# EAGLE design skycontrol-2008 (EAGLE 4.16)

## Sheet 1 of 2
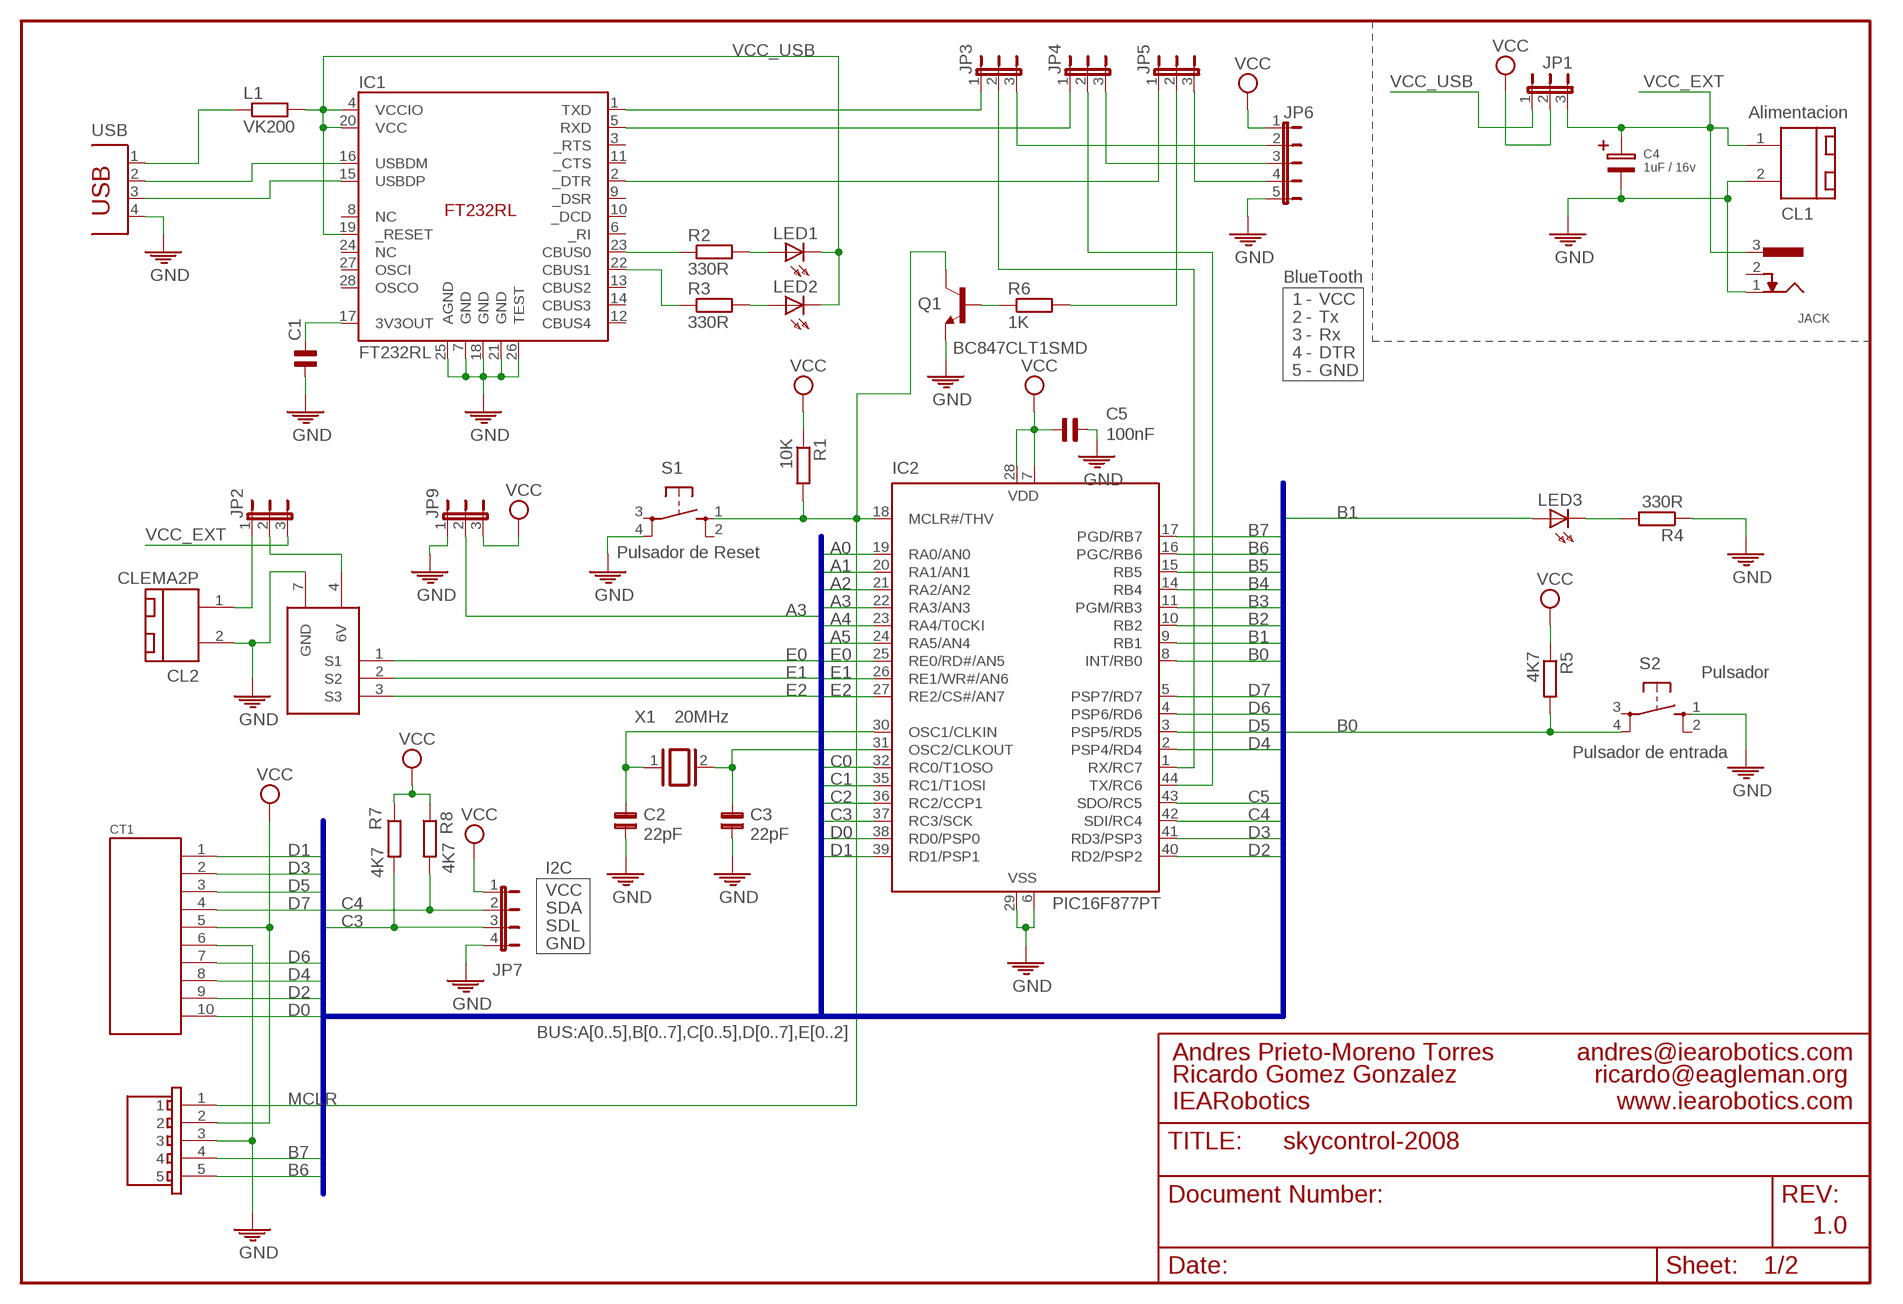
[diagram p0: schematic, sheet 1]

### Parts
C1  CON-MUL  [C0805K]
C2  22pF  CON-MUL  [C0805K]
C3  22pF  CON-MUL  [C0805K]
C4  1uF / 16v  CON-ELE-2.5  [C2]
C5  100nF  CON-MUL  [C0805K]
CL1  Alimentacion  CLEMA2P  [C2P]
CL2  CLEMA2P  [C2P]
CP1  CON-POWER-5RECTO  [CON-POWER-5]
CT1  CTCONA  [CTCON]
IC1  FT232RL  [SSOP-28]
IC2  PIC16F877PT  [TQFP44]
JACK  JACKP  [JACK]
JP1  JUMPER3R  [JP3R]
JP2  JUMPER3R  [JP3R]
JP3  JUMPER3R  [JP3R]
JP4  JUMPER3R  [JP3R]
JP5  JUMPER3R  [JP3R]
JP6  JUMPER5R  [1X05]
JP7  JUMPER4R  [1X04]
JP9  JUMPER3R  [JP3R]
L1  VK200  RESISTENCIA-10  [R207/10]
LED1  LED_SMD-SMT1206  [LED-1206]
LED2  LED_SMD-SMT1206  [LED-1206]
LED3  LED_SMD-SMT1206  [LED-1206]
Q1  BC847CLT1SMD  [SOT23]
R1  10K  RESISTENCIA-R0805  [R0805]
R2  330R  RESISTENCIA-R0805  [R0805]
R3  330R  RESISTENCIA-R0805  [R0805]
R4  330R  RESISTENCIA-R0805  [R0805]
R5  4K7  RESISTENCIA-R0805  [R0805]
R6  1K  RESISTENCIA-R0805  [R0805]
R7  4K7  RESISTENCIA-R0805  [R0805]
R8  4K7  RESISTENCIA-R0805  [R0805]
S1  PULSADORP  [PULSADOR-PEQUEÑO]
S2  PULSADORP  [PULSADOR-PEQUEÑO]
SERVOS  SERVOS3  [PAD3X3]
USB  PN61729  [PN61729]
X1  20MHz  XTALR  [XTAL-R]

### Nets
A0: IC2.19(RA0/AN0) ; also sheet 2
A1: IC2.20(RA1/AN1) ; also sheet 2
A2: IC2.21(RA2/AN2) ; also sheet 2
A3: IC2.22(RA3/AN3) JP9.2
A4: IC2.23(RA4/T0CKI) ; also sheet 2
A5: IC2.24(RA5/AN4) ; also sheet 2
B0: IC2.8(INT/RB0) R5.2 S2.4 ; also sheet 2
B1: IC2.9(RB1) LED3.A ; also sheet 2
B2: IC2.10(RB2) ; also sheet 2
B3: IC2.11(PGM/RB3) ; also sheet 2
B4: IC2.14(RB4) ; also sheet 2
B5: IC2.15(RB5) ; also sheet 2
B6: CP1.5 IC2.16(PGC/RB6) ; also sheet 2
B7: CP1.4 IC2.17(PGD/RB7) ; also sheet 2
C0: IC2.32(RC0/T1OSO) ; also sheet 2
C1: IC2.35(RC1/T1OSI) ; also sheet 2
C2: IC2.36(RC2/CCP1) ; also sheet 2
C3: IC2.37(RC3/SCK) JP7.3 R7.2
C4: IC2.42(SDI/RC4) JP7.2 R8.2
C5: IC2.43(SDO/RC5) ; also sheet 2
D0: CT1.10 IC2.38(RD0/PSP0)
D1: CT1.1 IC2.39(RD1/PSP1)
D2: CT1.9 IC2.40(RD2/PSP2)
D3: CT1.2 IC2.41(RD3/PSP3)
D4: CT1.8 IC2.2(PSP4/RD4)
D5: CT1.3 IC2.3(PSP5/RD5)
D6: CT1.7 IC2.4(PSP6/RD6)
D7: CT1.4 IC2.5(PSP7/RD7)
E0: IC2.25(RE0/RD#/AN5) SERVOS.1(S1)
E1: IC2.26(RE1/WR#/AN6) SERVOS.2(S2)
E2: IC2.27(RE2/CS#/AN7) SERVOS.3(S3)
GND: C1.1 C2.1 C3.1 C4.P$2 C5.1 CL1.2 CL2.2 CP1.3 CT1.6 IC1.7(GND) IC1.18(GND) IC1.21(GND) IC1.25(AGND) IC1.26(TEST) IC2.6(VSS) IC2.29(VSS) JACK.1 JP6.5 JP7.4 JP9.1 Q1.2(E) R4.1 S1.4 S2.1 SERVOS.7(GND) USB.4 ; also sheet 2
MCLR: CP1.1 IC2.18(MCLR#/THV) Q1.3(C) R1.2 S1.1
N$1: L1.1 USB.1
N$2: IC1.1(TXD) JP3.1
N$3: IC1.23(CBUS0) R2.1
N$4: IC1.22(CBUS1) R3.1
N$5: LED1.A R2.2
N$6: LED2.A R3.2
N$7: IC1.5(RXD) JP4.1
N$8: IC1.16(USBDM) USB.2
N$9: IC1.15(USBDP) USB.3
N$10: C1.2 IC1.17(3V3OUT)
N$11: IC1.2(_DTR) JP5.1
N$12: JP3.3 JP6.2
N$13: JP4.3 JP6.3
N$14: JP5.3 JP6.4
N$17: Q1.1(B) R6.1
N$18: JP5.2 R6.2
N$19: IC2.44(TX/RC6) JP4.2
N$20: IC2.1(RX/RC7) JP3.2
N$21: LED3.C R4.2
N$25: C3.2 IC2.31(OSC2/CLKOUT) X1.2
N$26: C2.2 IC2.30(OSC1/CLKIN) X1.1
N$61: JP2.2 SERVOS.4(6V)
N$63: CL2.1 JP2.1
VCC: C5.2 CP1.2 CT1.5 IC2.7(VDD) IC2.28(VDD) JP1.2 JP6.1 JP7.1 JP9.3 R1.1 R5.1 R7.1 R8.1 ; also sheet 2
VCC_EXT: C4.P$1 CL1.1 JACK.3 JP1.3 JP2.3 ; also sheet 2
VCC_USB: IC1.4(VCCIO) IC1.19(_RESET) IC1.20(VCC) JP1.1 L1.2 LED1.C LED2.C
Unconnected: IC1.3(_RTS) IC1.6(_RI) IC1.8(NC) IC1.9(_DSR) IC1.10(_DCD) IC1.11(_CTS) IC1.12(CBUS4) IC1.13(CBUS2) IC1.14(CBUS3) IC1.24(NC) IC1.27(OSCI) IC1.28(OSCO) JACK.2 S1.2 S1.3 S2.2 S2.3

### Buses
BUS:A[0..5],B[0..7],C[0..5],D[0..7],E[0..2]

### Notes on the sheet
- BlueTooth
- 1 | - | VCC
- 2 | - | Tx
- 3 | - | Rx
- 4 | - | DTR
- 5 | - | GND
- Pulsador de Reset
- Pulsador
- Pulsador de entrada
- I2C
- VCC
- SDA
- SDL
- GND
- Andres Prieto-Moreno Torres | andres@iearobotics.com
- Ricardo Gomez Gonzalez | ricardo@eagleman.org
- IEARobotics | www.iearobotics.com
- 1.0

## Sheet 2 of 2
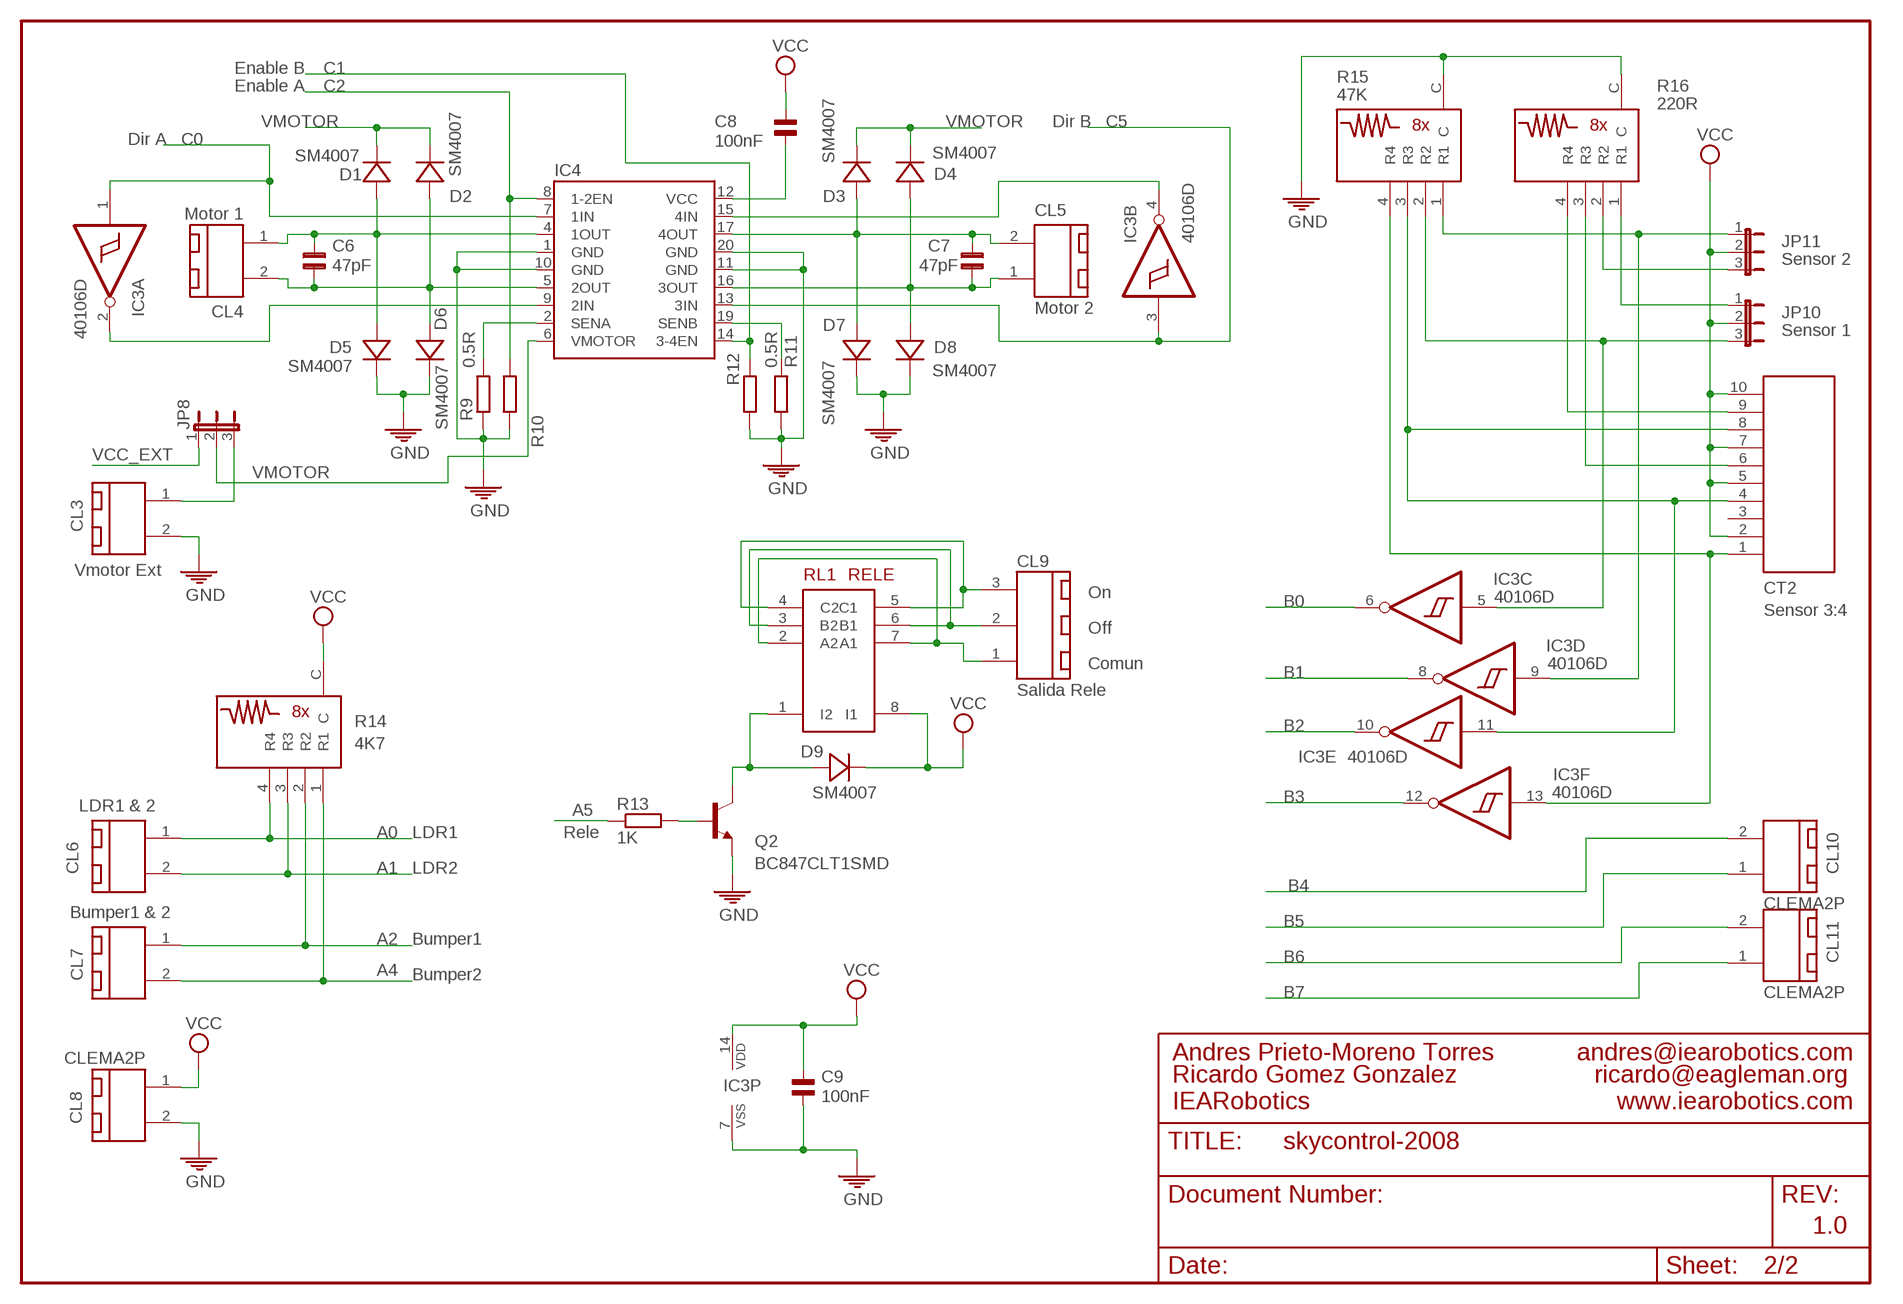
[diagram p1: schematic, sheet 2]

### Parts
C6  47pF  CON-MUL5  [C5]
C7  47pF  CON-MUL5  [C5]
C8  100nF  CON-MUL  [C0805K]
C9  100nF  CON-MUL  [C0805K]
CL3  Vmotor Ext  CLEMA2P  [C2P]
CL4  Motor 1  CLEMA2P  [C2P]
CL5  Motor 2  CLEMA2P  [C2P]
CL6  LDR1 & 2  CLEMA2P  [C2P]
CL7  Bumper1 & 2  CLEMA2P  [C2P]
CL8  CLEMA2P  [C2P]
CL9  Salida Rele  CLEMA3P  [C3P]
CL10  CLEMA2P  [C2P]
CL11  CLEMA2P  [C2P]
CT2  Sensor 3:4  CTCONA  [CTCON]
D1  SM4007  1N4148-DO213AC  [DO213AC]
D2  SM4007  1N4148-DO213AC  [DO213AC]
D3  SM4007  1N4148-DO213AC  [DO213AC]
D4  SM4007  1N4148-DO213AC  [DO213AC]
D5  SM4007  1N4148-DO213AC  [DO213AC]
D6  SM4007  1N4148-DO213AC  [DO213AC]
D7  SM4007  1N4148-DO213AC  [DO213AC]
D8  SM4007  1N4148-DO213AC  [DO213AC]
D9  SM4007  1N4148-DO213AC  [DO213AC]
IC3  40106D  [SO14]
IC4  L298-P  [POWERSO20]
JP8  JUMPER3R  [JP3R]
JP10  Sensor 1  JUMPER3R  [JP3R]
JP11  Sensor 2  JUMPER3R  [JP3R]
Q2  BC847CLT1SMD  [SOT23]
R9  0.5R  RESISTENCIA-R0805  [R0805]
R10  RESISTENCIA-R0805  [R0805]
R11  0.5R  RESISTENCIA-R0805  [R0805]
R12  RESISTENCIA-R0805  [R0805]
R13  1K  RESISTENCIA-R0805  [R0805]
R14  4K7  ARRAY4  [RED4]
R15  47K  ARRAY4  [RED4]
R16  220R  ARRAY4  [RED4]
RL1  RELE  [RELE]

### Nets
A0: CL6.1 R14.4(R4) ; also sheet 1
A1: CL6.2 R14.3(R3) ; also sheet 1
A2: CL7.1 R14.2(R2) ; also sheet 1
A4: CL7.2 R14.1(R1) ; also sheet 1
A5: R13.1 ; also sheet 1
B0: IC3.6(C:O) ; also sheet 1
B1: IC3.8(D:O) ; also sheet 1
B2: IC3.10(E:O) ; also sheet 1
B3: IC3.12(F:O) ; also sheet 1
B4: CL10.2 ; also sheet 1
B5: CL10.1 ; also sheet 1
B6: CL11.2 ; also sheet 1
B7: CL11.1 ; also sheet 1
C0: IC3.1(A:I) IC4.7(1IN) ; also sheet 1
C1: IC4.14(3-4EN) R12.2 ; also sheet 1
C2: IC4.8(1-2EN) R10.2 ; also sheet 1
C5: IC3.3(B:I) IC4.13(3IN) ; also sheet 1
GND: C9.1 CL3.2 CL8.2 D5.C D6.C D7.C D8.C IC3.7(P:VSS) IC4.1(GND) IC4.10(GND) IC4.11(GND) IC4.20(GND) Q2.2(E) R9.1 R10.1 R11.1 R12.1 R15.C R16.C ; also sheet 1
N$15: IC4.2(SENA) R9.2
N$16: IC4.19(SENB) R11.2
N$22: C8.2 IC4.12(VCC)
N$23: C7.1 CL5.2 D3.A D7.A IC4.17(4OUT)
N$24: C7.2 CL5.1 D4.A D8.A IC4.16(3OUT)
N$29: C6.2 CL4.2 D2.A D6.A IC4.5(2OUT)
N$30: C6.1 CL4.1 D1.A D5.A IC4.4(1OUT)
N$31: IC3.9(D:I) JP11.1 R15.1(R1)
N$32: IC3.4(B:O) IC4.15(4IN)
N$33: IC3.2(A:O) IC4.9(2IN)
N$35: CL9.1 RL1.2(A2) RL1.7(A1)
N$36: JP11.3 R16.2(R2)
N$37: JP10.1 R16.1(R1)
N$38: IC3.5(C:I) JP10.3 R15.2(R2)
N$39: Q2.1(B) R13.2
N$40: CL3.1 JP8.3
N$42: CT2.9 R16.4(R4)
N$43: CT2.4 CT2.8 IC3.11(E:I) R15.3(R3)
N$44: CT2.6 R16.3(R3)
N$45: CT2.1 IC3.13(F:I) R15.4(R4)
N$55: CL9.2 RL1.3(B2) RL1.6(B1)
N$56: CL9.3 RL1.4(C2) RL1.5(C1)
N$58: D9.A Q2.3(C) RL1.1(I2)
VCC: C8.1 C9.2 CL8.1 CT2.2 CT2.5 CT2.7 CT2.10 D9.C IC3.14(P:VDD) JP10.2 JP11.2 R14.C RL1.8(I1) ; also sheet 1
VCC_EXT: JP8.1 ; also sheet 1
VMOTOR: D1.C D2.C D3.C D4.C IC4.6(VMOTOR) JP8.2
Unconnected: CT2.3

### Notes on the sheet
- Enable B
- Enable A
- Dir B
- Dir A
- On
- Off
- Comun
- LDR1 | Rele
- LDR2
- Bumper1
- Bumper2
- Andres Prieto-Moreno Torres | andres@iearobotics.com
- Ricardo Gomez Gonzalez | ricardo@eagleman.org
- IEARobotics | www.iearobotics.com
- 1.0

## Library data of the parts
C1-C3 C5-C9 = IEARobotics:CON-MUL: Condensadores multicapa
C4 = IEARobotics:CON-ELE
CL1-CL8 CL10 CL11 = IEARobotics:CLEMA2: Clema doble
CL9 = IEARobotics:CLEMA3: clema 3 entradas
CP1 = IEARobotics:CON-POWER-5
CT1 CT2 = IEARobotics:CTCON: Conector compatible CT
D1-D9 = IEARobotics:1N4148: Diodo
IC1 = IEARobotics:FT232RL
IC2 = IEARobotics:PIC16F87*: MICROCONTROLLER
IC3 = IEARobotics:40106: Hex SCHMITT TRIGGER
IC4 = IEARobotics:L298
JACK = IEARobotics:JACK: Jack alimentacion
JP1-JP5 JP8-JP11 = IEARobotics:JUMPER3: jumper triple
JP6 = IEARobotics:JUMPER5
JP7 = IEARobotics:JUMPER4
L1 R1-R13 = IEARobotics:RESISTENCIA: Resistencia de paso 10mm
LED1-LED3 = IEARobotics:LED_SMD: Diodo LED
Q1 Q2 = IEARobotics:BC847*: NPN Transistor
R14-R16 = IEARobotics:ARRAY4
RL1 = IEARobotics:RELE
S1 S2 = IEARobotics:PULSADOR: Pulsador de circuito impreso
SERVOS = IEARobotics:SERVOS3
USB = IEARobotics:PN61729: BERG USB connector
X1 = IEARobotics:XTAL: XTAL

## Board
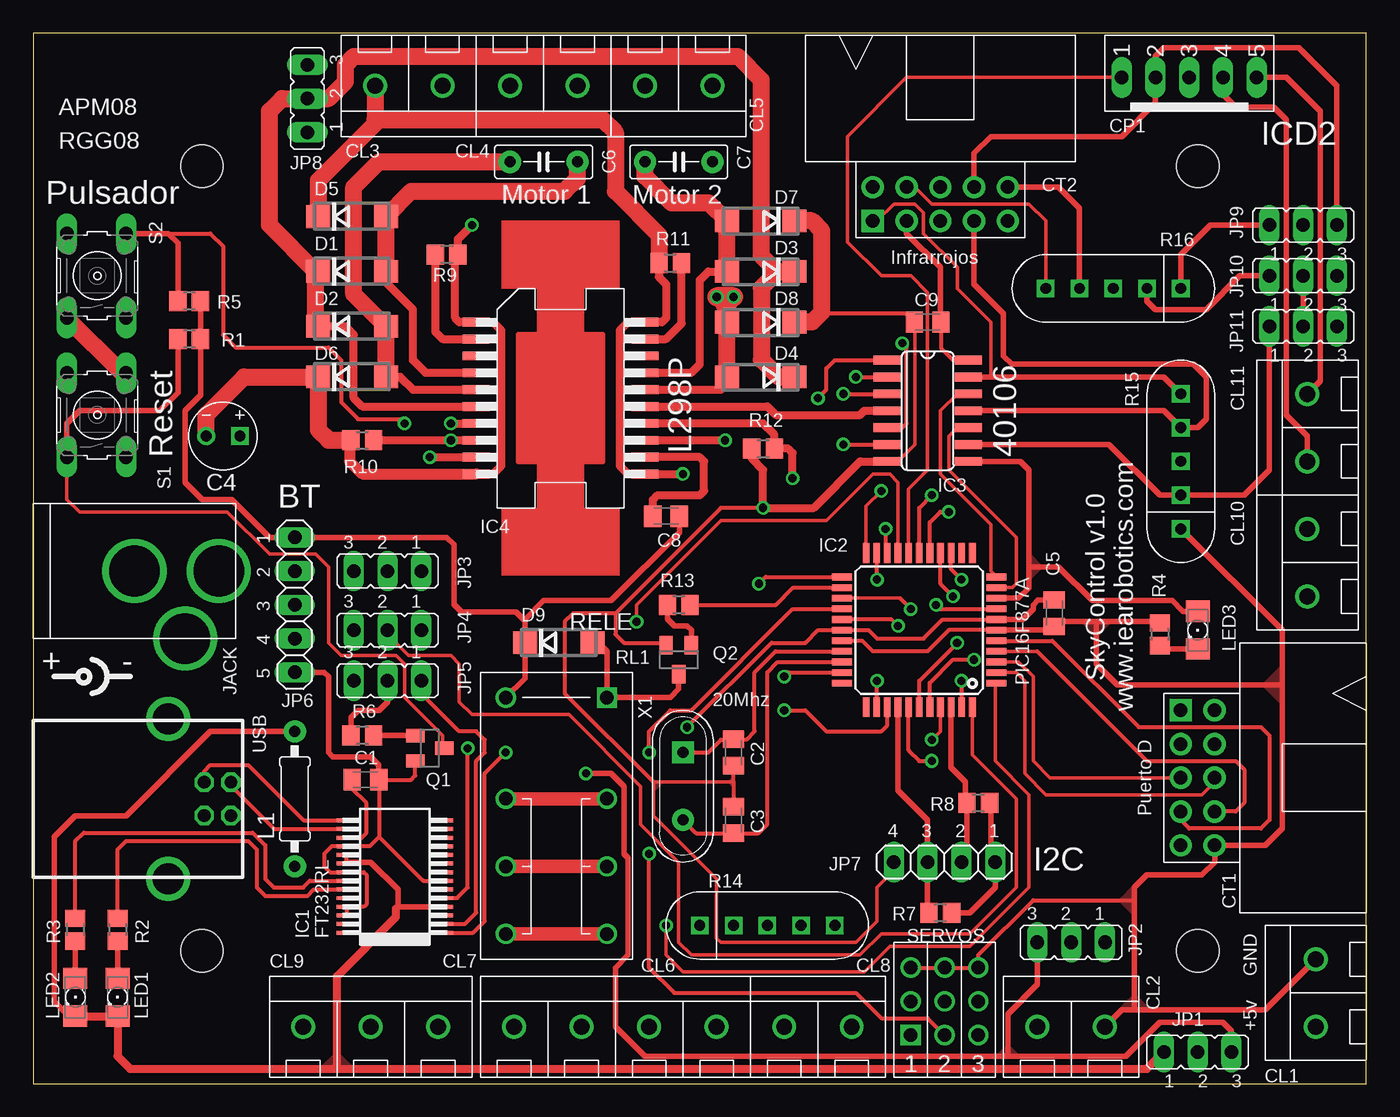
[diagram p2: board, top side]
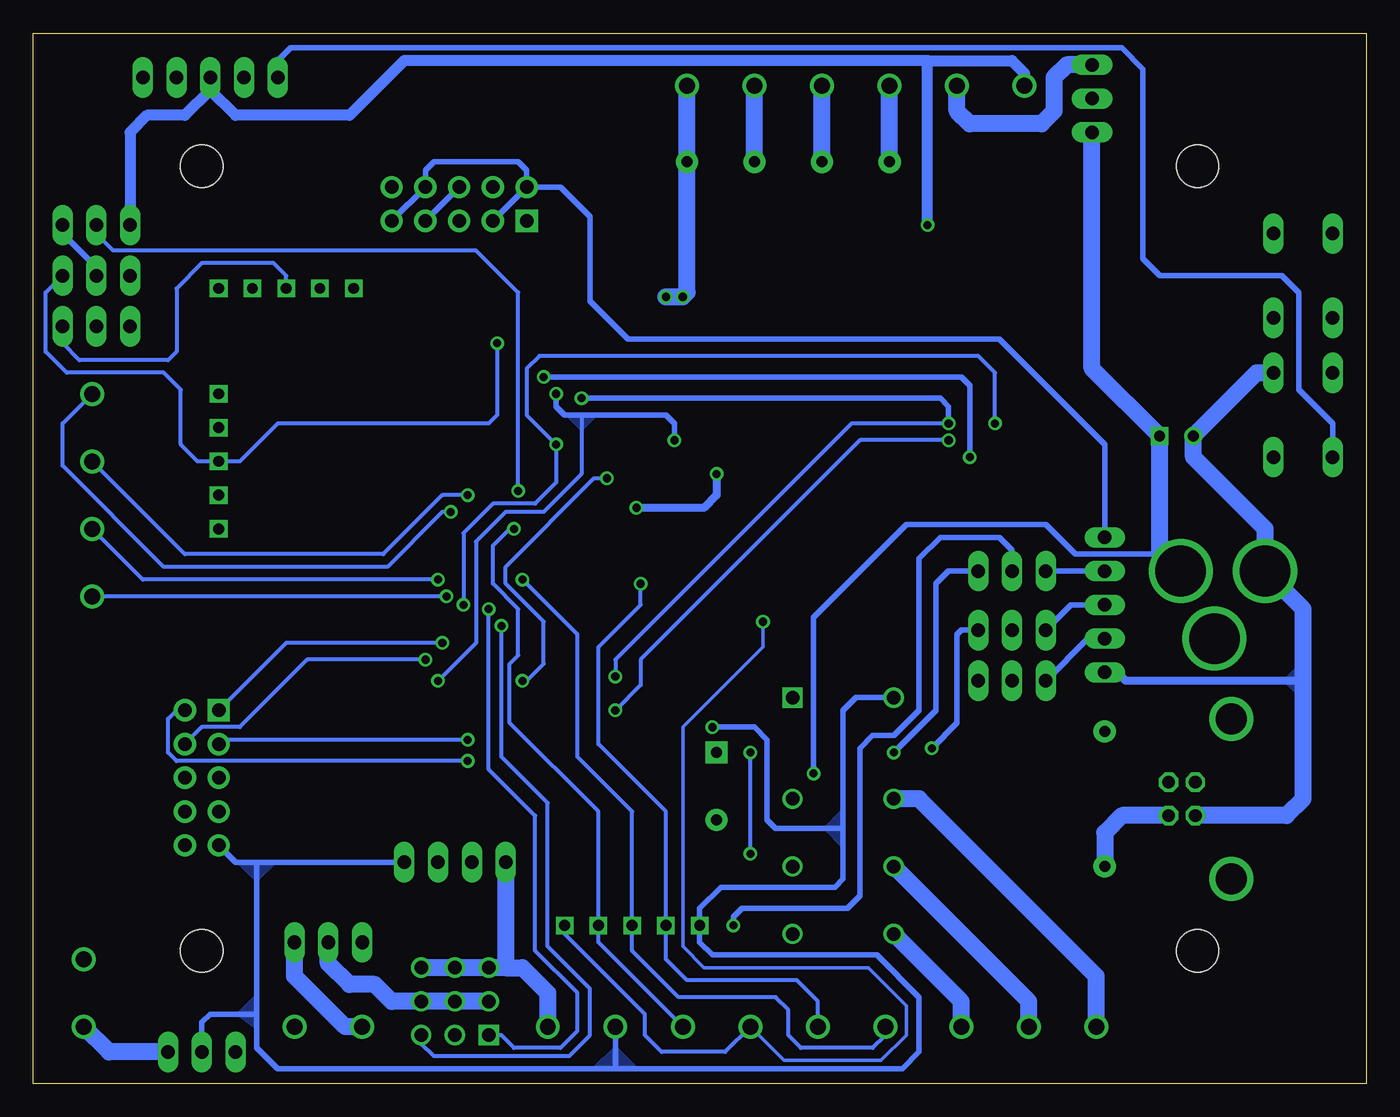
[diagram p3: board, bottom side, seen from below]

Size 100.31 x 79.05 mm. Coordinates in mm from the lower left corner, seen from the top.
Outline: 0,0 100.31,0 100.31,79.05 0,79.05 0,0
Copper layers (1*16): Top 0.035mm / dielectric 1.5mm / Bottom 0.035mm
Design rules "default": minimum track width 10mil, minimum drill 24mil, track to track 8mil, track to pad 8mil, pad to pad 8mil, via to via 8mil, smd to smd 8mil, copper to edge 30mil, drill to drill 8mil, minimum pad ring 10mil, minimum via ring 8mil, stop-mask expansion 4mil, vias tented up to drill 0mil, thermal gap 10mil
Holes 3.2 mm at 12.7,69.05 87.62,69.05 87.62,10 12.7,10
tRestrict: area 9.5,65.9 to 15.9,72.2; area 9.5,6.8 to 15.9,13.2; area 84.5,6.8 to 90.8,13.2; area 84.5,65.9 to 90.8,72.2
bRestrict: area 84.5,65.9 to 90.8,72.2; area 84.5,6.8 to 90.8,13.2; area 9.5,6.8 to 15.9,13.2; area 9.5,65.9 to 15.9,72.2

### Footprints (pad centres in the part's own frame; a part is rotated, then mirrored left to right if it is on the bottom)
C0805K = smd 1.3 x 1.6: 1 -1,0; 2 1,0
C2 = drill 0.813 square: P$1 0,0 | drill 0.813 round: P$2 2.54,0
C5 = drill 0.813 pad 1.676 round: 1 0,0; 2 5.08,0
C2P = drill 1.2 pad 1.676 round: 1 0,0; 2 5.08,0
C3P = drill 1.2 pad 1.676 round: 1 0,0; 2 5.08,0; 3 10.16,0
CON-POWER-5 = drill 1.016 long: 1 0,-5.08; 2 0,-2.54; 3 0,0; 4 0,2.54; 5 0,5.08
CTCON = drill 1.016 pad 1.676 square: 1 0,0 | drill 1.016 pad 1.676 round: 2 2.54,0; 3 5.08,0; 4 7.62,0; 5 10.16,0; 6 10.16,2.54; 7 7.62,2.54; 8 5.08,2.54; 9 2.54,2.54; 10 0,2.54
DO213AC = smd 1.8 x 1.7: A 3.05,0; C -2.05,0
SSOP-28 = smd 0.3 x 1.5: 1 -4.225,-3.625; 2 -3.575,-3.625; 3 -2.925,-3.625; 4 -2.275,-3.625; 5 -1.625,-3.625; 6 -0.975,-3.625; 7 -0.325,-3.625; 8 0.325,-3.625; 9 0.975,-3.625; 10 1.625,-3.625; 11 2.275,-3.625; 12 2.925,-3.625; 13 3.575,-3.625; 14 4.225,-3.625; 15 4.225,3.625; 16 3.575,3.625; 17 2.925,3.625; 18 2.275,3.625; 19 1.625,3.625; 20 0.975,3.625; 21 0.325,3.625; 22 -0.325,3.625; 23 -0.975,3.625; 24 -1.625,3.625; 25 -2.275,3.625; 26 -2.925,3.625; 27 -3.575,3.625; 28 -4.225,3.625
TQFP44 = smd 1.5 x 0.5: 1 -5.8,4; 2 -5.8,3.2; 3 -5.8,2.4; 4 -5.8,1.6; 5 -5.8,0.8; 6 -5.8,0; 7 -5.8,-0.8; 8 -5.8,-1.6; 9 -5.8,-2.4; 10 -5.8,-3.2; 11 -5.8,-4; 23 5.8,-4; 24 5.8,-3.2; 25 5.8,-2.4; 26 5.8,-1.6; 27 5.8,-0.8; 28 5.8,0; 29 5.8,0.8; 30 5.8,1.6; 31 5.8,2.4; 32 5.8,3.2; 33 5.8,4 | smd 0.5 x 1.5: 12 -4,-5.8; 13 -3.2,-5.8; 14 -2.4,-5.8; 15 -1.6,-5.8; 16 -0.8,-5.8; 17 0,-5.8; 18 0.8,-5.8; 19 1.6,-5.8; 20 2.4,-5.8; 21 3.2,-5.8; 22 4,-5.8; 34 4,5.8; 35 3.2,5.8; 36 2.4,5.8; 37 1.6,5.8; 38 0.8,5.8; 39 0,5.8; 40 -0.8,5.8; 41 -1.6,5.8; 42 -2.4,5.8; 43 -3.2,5.8; 44 -4,5.8
SO14 = smd 0.66 x 2.032: 1 -3.81,-3.073; 2 -2.54,-3.073; 3 -1.27,-3.073; 4 0,-3.073; 5 1.27,-3.073; 6 2.54,-3.073; 7 3.81,-3.073; 8 3.81,3.073; 9 2.54,3.073; 10 1.27,3.073; 11 0,3.073; 12 -1.27,3.073; 13 -2.54,3.073; 14 -3.81,3.073
POWERSO20 = smd 0.66 x 2.032: 1 0,0; 2 1.27,0; 3 2.54,0; 4 3.81,0; 5 5.08,0; 6 6.35,0; 7 7.62,0; 8 8.89,0; 9 10.16,0; 10 11.43,0; 11 11.43,12.7; 12 10.16,12.7; 13 8.89,12.7; 14 7.62,12.7; 15 6.35,12.7; 16 5.08,12.7; 17 3.81,12.7; 18 2.54,12.7; 19 1.27,12.7; 20 0,12.7
JACK = drill 3.81 round: 1 0,-7.62; 2 5.08,-3.81; 3 0,-1.27
JP3R = drill 1.016 long: 1 0,0; 2 2.54,0; 3 5.08,0
1X05 = drill 1.016 long: 1 0,0; 2 2.54,0; 3 5.08,0; 4 7.62,0; 5 10.16,0
1X04 = drill 1.016 long: 1 0,0; 2 2.54,0; 3 5.08,0; 4 7.62,0
R207/10 = drill 0.813 pad 1.676 round: 1 -5.08,0; 2 5.08,0
LED-1206 = smd 1.6 x 1.803: A -1.422,0; C 1.422,0
SOT23 = smd 1 x 1.4: 1 -0.95,-1.1; 2 0.95,-1.1; 3 0,1.1
R0805 = smd 1.3 x 1.5: 1 -0.85,0; 2 0.85,0
RED4 = drill 0.813 square: 1 2.54,0; 2 5.08,0; 3 7.62,0; 4 10.16,0; C 0,0
RELE = drill 1.016 square: 1 0,0 | drill 1.016 round: 2 0,7.62; 3 0,12.7; 4 0,17.78; 5 7.62,17.78; 6 7.62,12.7; 7 7.62,7.62; 8 7.62,0
PULSADOR-PEQUEÑO = drill 1.016 long: 1 0,0; 2 6.35,0; 3 0,-4.445; 4 6.35,-4.445
PAD3X3 = drill 1.016 square: 1 0,0 | drill 1.016 round: 2 2.54,0; 3 5.08,0; 4 0,2.54; 5 2.54,2.54; 6 5.08,2.54; 7 0,5.08; 8 2.54,5.08; 9 5.08,5.08
PN61729 = drill 0.95 octagon: 1 1.25,4.71; 2 -1.25,4.71; 3 -1.25,2.71; 4 1.25,2.71 | drill 2.3 round: 5 -6.016,0; 6 6.021,0
XTAL-R = drill 0.813 pad 1.676 square: 1 0,0 | drill 0.813 pad 1.676 round: 2 5.08,0

### Placement (x,y rotation side)
C1  25,22.87 180 top
C2  52.7,24.92 90 top
C3  52.7,19.84 270 top
C4  15.55,48.73 180 top
C5  76.83,35.39 90 top
C6  40.95,69.37 180 top
C7  46.03,69.37 0 top
C8  47.62,42.7 180 top
C9  67.3,57.3 0 top
CL1  96.52,4.28 90 top
CL2  75.56,4.28 0 top
CL3  30.79,75.08 180 top
CL4  40.95,75.08 180 top
CL5  51.11,75.08 180 top
CL6  46.35,4.28 0 top
CL7  36.19,4.28 0 top
CL8  56.51,4.28 0 top
CL9  20.32,4.28 0 top
CL10  95.88,36.66 90 top
CL11  95.88,46.82 90 top
CP1  86.99,75.72 270 top
CT1  86.35,28.09 270 top
CT2  63.18,64.92 0 top
D1  23.49,61.11 0 top
D2  23.49,56.98 0 top
D3  55.24,61.11 180 top
D4  55.24,53.17 180 top
D5  23.49,65.24 0 top
D6  23.49,53.17 0 top
D7  55.24,64.92 180 top
D8  55.24,57.3 180 top
D9  39.05,33.17 0 top
IC1  27.22,15.58 90 top
IC2  66.67,34.12 180 top
IC3  67.3,50.63 270 top
IC4  33.33,57.3 270 top
JACK  15.23,38.57 270 top
JP1  85.08,2.38 0 top
JP2  80.64,10.63 180 top
JP3  29.21,38.57 180 top
JP4  29.21,34.12 180 top
JP5  29.21,30.32 180 top
JP6  19.68,41.11 270 top
JP7  72.38,16.66 180 top
JP8  20.63,71.59 90 top
JP9  93.02,64.61 0 top
JP10  93.02,60.79 0 top
JP11  93.02,56.98 0 top
L1  19.68,21.43 90 top
LED1  6.35,6.5 270 top
LED2  3.17,6.5 270 top
LED3  87.62,34.12 270 top
Q1  29.84,25.23 270 top
Q2  48.57,31.9 180 top
R1  11.74,56.03 180 top
R2  6.35,11.58 270 top
R3  3.17,11.58 270 top
R4  84.77,33.81 270 top
R5  11.74,58.89 180 top
R6  24.76,26.19 180 top
R7  68.26,12.85 180 top
R8  71.11,21.11 180 top
R9  31.11,62.38 180 top
R10  24.76,48.41 0 top
R11  47.94,61.75 0 top
R12  54.92,47.78 0 top
R13  48.57,36.03 180 top
R14  50.16,11.9 0 top
R15  86.35,41.74 90 top
R16  86.35,59.84 180 top
RL1  43.17,29.05 180 top
S1  2.54,47.14 90 top
S2  2.54,57.62 90 top
SERVOS  66.03,3.65 0 top
USB  10.16,21.43 270 top
X1  48.89,24.92 270 top

### Tracks (layer width: path | path; a pad name or v marks a point on that pad's centre or on a via)
A0  (via drill 0.61)
  Top 0.254: 65.08,39.91 IC2.19 65.07,39.85 65.08,39.84 65.08,45.24 64.45,45.87 63.18,45.87 59.69,42.38 51.75,42.38 45.4,36.03 v45.4,34.76
  Bottom 0.254: v45.4,34.76 45.4,32.85 51.43,26.82 51.43,10.31 49.84,8.72 37.46,8.72 34.6,5.87 34.6,3.65 36.51,1.74 43.81,1.74 CL6.1
  Bottom 0.305: CL6.1 48.25,2.38 53.02,2.38 54.29,3.65 54.29,5.23 60.32,11.27 R14.4
A1  (via drill 0.61)
  Top 0.254: IC2.20 64.22,39.92
  Top 0.305: IC2.20 64.19,39.84 64.13,39.84 v64.13,41.74
  Bottom 0.305: CL6.2 57.78,10.63 R14.3 57.78,20.47 64.45,27.14 64.45,31.59 63.81,32.22 63.81,35.71 65.72,37.62 65.72,40.47 64.45,41.74
  Bottom 0.406: 64.45,41.74 v64.13,41.74
A2  (via drill 0.61)
  Top 0.305: IC2.21 63.5,39.9 v63.5,37.93
  Bottom 0.305: CL7.1 36.19,3.65 37.14,2.69 42.54,2.69 43.49,3.65 43.49,5.55 44.44,6.5 51.75,6.5 55.24,10 R14.2 55.24,20.47 59.37,24.6 59.37,33.81 v63.5,37.93
A3  (via drill 0.61)
  Top 0.254: IC2.22 62.67,43.46 v63.81,44.6
  Bottom 0.305: v63.81,44.6 63.81,59.52 66.99,62.7 94.29,62.7 95.56,63.97 JP9.2
A4  (via drill 0.61)
  Top 0.305: IC2.23 55.11,38.12 v54.61,37.62
  Bottom 0.305: CL7.2 41.27,6.19 42.86,7.77 51.11,7.77 52.7,9.36 R14.1 52.7,20.47 57.78,25.55 57.78,32.85 54.61,36.03 v54.61,37.62
A5
  Top 0.305: IC2.24 57.17,37.32 55.88,36.03 R13.1 49.21,36.03
B0  (via drill 0.61)
  Top 0.305: S2.4 13.33,63.97 14.28,63.02 14.28,56.35 15.23,55.4 22.22,55.4 23.17,54.45 23.17,51.27 24.44,50 27.62,50 v27.93,49.68 | v60.95,48.09 IC3.6 | v67.94,36.03 68.26,35.71 72.46,35.71 IC2.8
  Top 0.406: R5.2 10.89,63.23 10.16,63.97 S2.4
  Bottom 0.305: v27.93,49.68 27.93,53.49 29.21,54.76 62.22,54.76 63.18,53.81 63.18,50.32 v60.95,48.09 60.95,45.24 62.54,43.65 65.72,43.65 67.94,41.43 v67.94,36.03
B1
  Top 0.406: IC2.9 74.15,36.52 74.92,37.3 74.92,38.89 | 74.92,38.89 74.92,46.19 74.29,46.82 IC3.8 | LED3.A 86.52,35.55 85.72,36.35 79.69,36.35 77.15,38.89 74.92,38.89
  pour Top: 74.92,39.52 74.92,37.93 75.88,38.89 74.92,39.84
B2
  Top 0.254: IC3.10 69.53,49.36 68.89,48.73 68.89,46.19 73.97,41.11 73.97,37.62 73.68,37.32 IC2.10
B3
  Top 0.254: IC3.12 69.53,51.9 68.26,50.63 68.26,45.87 72.07,42.06 72.07,38.57 72.47,38.17 IC2.11
B4  (via drill 0.61)
  Top 0.305: IC2.14 69.07,38.71 v69.84,37.93
  Bottom 0.305: v69.84,37.93 92.07,37.93 CL10.2
B5  (via drill 0.61)
  Top 0.305: IC2.15 68.27,37.6 v69.21,36.66
  Bottom 0.305: v69.21,36.66 CL10.1
B6  (via drill 0.61)
  Top 0.305: IC2.16 67.47,42.23 68.26,43.01 v68.89,43.01
  Top 0.406: CP1.5 94.29,75.72 96.83,73.18 96.83,52.86 CL11.2
  Bottom 0.305: v68.89,43.01 69.53,43.01 69.84,42.7 73.66,38.89 90.48,38.89 98.1,46.51 98.1,49.68 CL11.2
B7  (via drill 0.61)
  Top 0.305: IC2.17 66.67,43.33 v67.62,44.28
  Top 0.406: CP1.4 89.53,74.45 90.48,73.5 93.34,73.5 94.29,72.54 94.29,50.32 95.88,48.73 CL11.1
  Bottom 0.305: v67.62,44.28 69.53,44.28 73.97,39.84 88.89,39.84 CL11.1
C0  (via drill 0.61)
  Top 0.305: v56.51,30.63 56.83,30.95 60.89,30.95 | v59.05,51.59 59.69,52.22 59.69,53.81 60.32,54.45 IC3.1 | 60.89,30.95 60.95,30.95 | 60.89,30.95 IC2.32
  Top 0.61: v31.43,49.68 IC4.7
  Bottom 0.305: v31.43,49.68 38.73,49.68 56.51,31.9 v56.51,30.63
  Bottom 0.406: v59.05,51.59 32.06,51.59 31.43,50.95 v31.43,49.68
C1  (via drill 0.61)
  Top 0.305: IC2.35 63.47,30.29 v63.5,30.32
  Top 0.61: IC4.14 54.92,49.68 55.77,48.83 R12.2 56.83,47.78 57.14,47.46 v57.14,45.55
  Bottom 0.305: v63.5,30.32 63.18,30.32 61.91,31.59 61.91,34.76 64.77,37.62 64.77,38.89 58.1,45.55 v57.14,45.55
C2  (via drill 0.61)
  Top 0.305: v56.51,28.09 58.1,28.09 59.69,26.5 63.81,26.5 64.27,26.96 IC2.36
  Top 0.61: R10.2 v31.43,48.41 IC4.8
  Bottom 0.305: v31.43,48.41 38.09,48.41 54.61,31.9 54.61,30 v56.51,28.09
C3
  Top 0.406: IC2.37 65.07,22.07 67.3,19.84 JP7.3 67.3,12.85 R7.2
C4
  Top 0.406: IC2.42 69.07,23.79 70.16,22.7 70.16,21.11 R8.2 70.27,17.08 JP7.2
C5  (via drill 0.61)
  Top 0.305: v60.95,51.9 IC3.3 | IC2.43 69.84,28.35 v69.84,30.32
  Top 0.61: IC4.13 v52.06,48.41
  Bottom 0.305: v69.84,30.32 66.99,33.17 66.99,40.79 64.77,43.01 61.91,43.01 59.05,45.87 59.05,50.32
  Bottom 0.406: v52.06,48.41 52.06,49.68 52.7,50.32 59.05,50.32 60.32,50.32 60.95,50.95 v60.95,51.9
  pour Bottom: 58.1,50.32 59.05,49.36 60,50.32
D0  (via drill 0.61)
  Top 0.305: IC2.38 65.87,25.08 66.67,24.28 v67.62,24.28
  Bottom 0.305: CT1.10 89.53,28.09 90.16,27.46 90.16,24.92 89.53,24.28 v67.62,24.28
D1  (via drill 0.61)
  Top 0.305: v69.53,33.17 66.67,30.32 IC2.39
  Bottom 0.305: v69.53,33.17 81.27,33.17 CT1.1
D2  (via drill 0.61)
  Top 0.305: v70.8,31.9 69.21,31.9 67.47,30.16 IC2.40
  Bottom 0.305: v70.8,31.9 79.69,31.9 84.77,26.82 87.62,26.82 CT1.9
D3  (via drill 0.61)
  Top 0.254: IC2.41 68.27,26.52 v67.62,25.87
  Bottom 0.305: CT1.2 86.04,25.87 v67.62,25.87
D4
  Top 0.254: IC2.2 74,30.93 74.61,30.32 74.61,23.33 76.19,21.74 87.94,21.74 88.89,22.7 CT1.8
D5
  Top 0.254: IC2.3 74.15,31.73 75.24,30.63 75.24,24.28 76.51,23.01 CT1.3
D6
  Top 0.254: 72.7,32.54 75.56,32.54
  Top 0.305: CT1.7 90.48,20.47 91.12,21.11 91.12,23.65 90.48,24.28 83.81,24.28 75.56,32.54 | 72.7,32.54 72.69,32.52 IC2.4
D7
  Top 0.305: CT1.4 86.35,19.84 86.99,19.2 92.39,19.2 93.02,19.84 93.02,26.19 92.39,26.82 83.18,26.82 76.68,33.32 IC2.5
E0  (via drill 0.61)
  Top 0.254: 65.22,36.52 IC2.25
  Top 0.305: v66.03,35.71 65.22,36.52
  Bottom 0.305: v66.03,35.71 66.03,23.65 62.54,20.16 62.54,10 59.37,6.82 59.37,3.96 60.64,2.69 64.13,2.69 65.08,3.65 SERVOS.1
E1  (via drill 0.61)
  Top 0.305: v46.35,24.92 46.35,26.5 47.94,28.09 49.53,28.09 57.14,35.71 60.88,35.71 | v46.35,17.3 46.35,8.72 48.25,6.82 61.91,6.82 63.81,4.92 67.3,4.92 SERVOS.2 | 60.88,35.71 60.95,35.71 | 60.88,35.71 IC2.26
  Bottom 0.305: v46.35,17.3 v46.35,24.92
E2  (via drill 0.61)
  Top 0.254: v65.08,34.44 64.6,34.92
  Top 0.305: 64.6,34.92 IC2.27
  Bottom 0.305: SERVOS.3 71.11,3.01 70.16,2.06 60,2.06 58.42,3.65 58.42,7.14 61.59,10.31 61.59,21.11 65.08,24.6 v65.08,34.44
GND  (via drill 0.61)
  Top 0.254: 52.7,22.7 46.67,22.7 46.67,20.16 51.43,15.39 51.43,10.95 51.75,10.63 61.91,10.63 63.5,12.22 63.5,14.76 64.77,16.03 JP7.4 | IC3.7 65.08,46.82 66.35,48.09 66.35,57.25
  Top 0.305: 26.03,18.57 25.32,17.86 IC1.18 22.46,17.86 21.9,17.3 21.9,16.34 22.34,15.91 IC1.21 24.88,15.91 25.08,15.71 25.08,13.49 24.9,13.31 IC1.25 | 26.03,18.57 26.03,22.84 C1.1 28.43,22.87 28.74,23.18 Q1.2 | IC1.25 | IC1.25 IC1.26 | 26.03,18.57 26.03,18.57 arc90 26.03,18.57 | C2.1 52.7,22.7 C3.1 | IC2.6 68.89,34.12 67.3,32.54 63.18,32.54 62.39,33.32 IC2.29 | 82.86,13.8 75.24,13.8 71.11,9.68 71.11,8.72 SERVOS.7 | IC1.7 29.34,15.26 26.03,18.57 | Q2.2 47.62,32.86 47.62,32.85 47.3,33.17 44.44,33.17 43.81,33.81 43.81,35.39 | v54.92,43.33 51.75,43.33 43.81,35.39 | 43.81,35.39 40.64,35.39 40,34.76 40,29.36 46.67,22.7 | 66.35,57.25 66.35,57.3 C9.1 65.67,57.94 59.37,57.94 | 59.37,57.94 | 59.37,57.94 59.3,58
  Top 0.406: C5.1 | IC2.6 76.56,34.12 C5.1 | C1.1 26,23.99 25.39,24.6 22.54,24.6 22.22,24.92 22.22,30.63 21.9,30.95 JP6.5 | 84.77,34.76 84.66,34.76 R4.1 84.77,34.76 | 82.86,5.55 81.91,5.55 CL2.2 | 82.86,5.55 92.7,5.55 CL1.2 | 82.86,5.55 82.86,13.8 82.86,14.76 83.81,15.71 87.94,15.71 88.89,16.66 CT1.6 92.7,17.93 93.97,19.2 93.97,30 | R16.C 86.35,62.38 88.58,64.61 JP9.1 | 93.97,30 93.97,34.12 R15.C | 93.97,30 81.59,30 80,31.59 80,34.76 | C5.1 77.19,34.76 80,34.76 | 80,34.76 84.77,34.76
  Top 0.61: IC4.10 34.6,45.87 35.24,46.51 35.24,56.67 34.6,57.3 IC4.1 32.06,57.3 31.75,57.62 31.75,62.38 R9.1 31.96,63.55 v33.02,64.61 | IC3.7 62.22,46.82 58.73,43.33 v54.92,43.33 54.92,46.19 54.07,47.04 R12.1 | R11.1 47.09,60.69 47.62,60.16 47.62,57.62 47.3,57.3 IC4.20 44.76,57.3 44.13,56.67 44.13,46.51 44.76,45.87 IC4.11 v48.89,45.87
  Top 0.813: IC4.10 24.76,45.87 23.81,46.82 23.81,48.41
  Top 1.27: S2.1 6.66,53.49 S1.4 | D5.C 21.44,67.95 25.71,72.23 25.71,72.54 | CL3.2 25.71,72.54 | D7.C 58.58,64.92 59.34,64.16 59.34,58.04 59.3,58 58.61,57.31 D8.C | C4.P$2 13.01,50.32 15.87,53.17 D6.C 21.44,49.19 22.22,48.41 23.81,48.41 R10.1 | 25.71,72.54 42.86,72.54 43.81,71.59 43.81,67.15 47.09,63.87 R11.1
  Top 1.778: D8.C | D8.C
  Bottom 0.61: JP6.5 18.73,30.95 18.09,30.32 4.76,30.32 | v48.89,45.87 48.89,44.28 49.84,43.33 v54.92,43.33
  Bottom 0.813: 86.99,74.77 CP1.3 | 86.99,74.77 88.89,72.86 91.75,72.86 93.02,71.59 JP9.1 | CL3.2 25.71,76.04 26.66,76.99 33.02,76.99 | v33.02,64.61 33.02,76.99 | 33.02,76.99 72.38,76.99 76.51,72.86 85.08,72.86 86.99,74.77
  Bottom 1.27: USB.4 6.01,20.18 4.76,21.43 4.76,30.32 4.76,35.71 JACK.1 7.62,41.74 13.01,47.14 C4.P$2 8.25,53.49 S1.4 | 71.11,8.72 SERVOS.7 64.77,8.72 | CL8.2 61.59,6.82 63.5,8.72 64.77,8.72 | JP7.4 64.77,8.72
  pour Bottom: 4.76,31.59 6.03,30.32 4.76,29.05
  pour Top: 82.86,6.5 81.91,5.55 83.81,5.55
  pour Top: 46.67,22.7 47.3,22.7 46.67,22.06
  pour Top: 52.7,23.01 52.38,22.7 52.7,22.38
  pour Top: 82.86,14.76 82.86,12.85 81.91,13.8
  pour Top: 79.05,34.76 80,33.81 80.96,34.76
  pour Top: 92.7,30 93.97,31.27 93.97,28.73
MCLR
  Top 0.254: S1.1 2.54,43.97 3.49,43.01 14.6,43.01 17.77,39.84 21.27,39.84 22.22,38.89 22.22,33.17 23.17,32.22 27.3,32.22 27.93,31.59 27.93,29.05 30.79,26.19 30.79,25.23 Q1.3 | CP1.1 65.72,75.72 61.27,71.27 61.27,63.33 63.81,60.79 66.03,60.79 67.3,59.52 67.3,46.19 65.87,44.75 IC2.18
  Top 0.406: R1.2 10.89,52.01 9.52,50.63 3.49,50.63 2.54,49.68 S1.1
  Bottom 0.406: CP1.1 81.91,76.99 80.96,77.94 18.41,77.94 16.82,76.35 16.82,62.06 15.55,60.79 6.35,60.79 5.08,59.52 5.08,52.22 2.54,49.68 S1.1
N$1
  Bottom 1.27: USB.1 18.39,20.18 19.68,18.89 L1.1
N$2  (via drill 0.61)
  Top 0.305: v35.56,24.92 33.97,23.33 33.97,12.22 33.11,11.36 IC1.1
  Bottom 0.406: JP3.1 31.43,38.57 32.38,37.62 32.38,28.09 v35.56,24.92
N$3
  Top 0.305: IC1.23 21.12,14.61 20.63,14.12 17.46,14.12 16.82,14.76 16.82,17.62 16.19,18.25 6.98,18.25 6.35,17.62 R2.1
N$4
  Top 0.305: IC1.22 20.82,15.26 20.32,14.76 18.09,14.76 17.46,15.39 17.46,17.93 16.51,18.89 3.81,18.89 3.17,18.25 R3.1
N$5
  Top 0.406: LED1.A R2.2 | LED1.A
N$6
  Top 0.406: LED2.A | LED2.A | LED2.A R3.2 | LED2.A
N$7  (via drill 0.61)
  Top 0.305: v32.7,25.23 32.7,14.76 31.9,13.96 IC1.5
  Bottom 0.406: JP4.1 30.48,34.12 30.79,33.81 30.79,27.14 v32.7,25.23
N$8
  Top 0.305: IC1.16 18.14,19.16 14.87,22.43 USB.2
N$9
  Top 0.305: IC1.15 20.34,19.81 16.19,23.96 13.33,23.96 12.87,23.5 USB.3
N$10
  Top 0.305: IC1.17 24.7,18.51 25.08,18.89 25.08,21.11 24,22.18 C1.2
N$11
  Top 0.305: IC1.2 32.49,12.01 33.33,12.85 33.33,24.28 33.97,24.92 33.97,25.87 33.33,26.5 32.06,26.5 29.21,29.36 JP5.1
N$12
  Bottom 0.406: JP6.2 JP3.3
N$13
  Bottom 0.406: JP6.3 22.22,36.03 JP4.3
N$14
  Bottom 0.406: JP6.4 20.95,33.49 JP5.3
N$15
  Top 0.61: R9.2 30.26,56.56 30.79,56.03 IC4.2
N$16
  Top 0.61: IC4.19 47.62,56.03 48.79,57.2 R11.2
N$17
  Top 0.406: Q1.1 | Q1.1 | R6.1 Q1.1
N$18
  Top 0.406: R6.2 23.91,27.56 24.44,28.09 26.03,28.09 26.66,28.73 JP5.2
N$19
  Top 0.254: JP4.2 26.66,33.81 28.25,32.22 31.43,32.22 32.06,31.59 32.06,28.73 33.02,27.78 40.32,27.78 45.72,22.38 45.72,19.52 48.57,16.66 48.57,10.63 49.53,9.68 62.22,9.68 63.81,11.27 70.48,11.27 73.97,14.76 73.97,21.43 70.67,24.73 IC2.44
N$20  (via drill 0.61)
  Top 0.254: 72.38,30 72.38,24.28 74.92,21.74 74.92,14.76 70.48,10.31 64.45,10.31 62.54,8.41 48.89,8.41 47.62,9.68 v47.62,11.9
  Top 0.305: IC2.1 72.38,30.04 72.38,30
  Bottom 0.406: v47.62,11.9 47.62,12.54 46.98,13.17 39.05,13.17 38.09,14.12 38.09,25.23 37.14,26.19 35.56,26.19 33.65,28.09 33.65,39.52 32.06,41.11 27.62,41.11 26.66,40.16 JP3.2
N$21
  Top 0.406: R4.2 | R4.2 | LED3.C 85.02,32.7 R4.2
N$22
  Top 0.61: C8.2 46.62,43.92 46.98,44.28 50.16,44.28 50.48,44.6 50.48,46.82 50.16,47.14 IC4.12
N$23
  Top 0.61: D3.A 50.8,61.11 50.16,60.48 50.16,54.13 49.53,53.49 IC4.17
  Top 1.27: D3.A D7.A 50.84,66.27 48.05,66.27 46.03,68.29 C7.1
  Top 1.778: D3.A | D3.A | D3.A
  Bottom 1.27: C7.1 CL5.2
N$24  (via drill 0.61)
  Top 0.61: IC4.16 51.75,52.22 52.7,53.17 D4.A
  Top 1.27: D4.A D8.A 52.19,58.7
  Top 1.422: 52.19,58.7 v52.7,59.21 | v52.7,59.21 v51.43,59.21 | v52.7,59.21 52.06,58.57
  Top 1.778: D4.A | D4.A
  Bottom 1.27: CL5.1 C7.2 51.11,59.52 v51.43,59.21 v52.7,59.21
N$25
  Top 0.305: X1.2 49.89,18.84 C3.2 54.56,18.84 55.24,19.52 55.24,30.95 56.02,31.73 IC2.31
N$26
  Top 0.305: IC2.30 55.86,32.52 54.29,30.95 54.29,26.5 53.7,25.92 C2.2 52.7,25.87 51.75,25.87 50.8,24.92 X1.1
N$29
  Top 0.61: D6.A 27.62,53.18 28.57,52.22 IC4.5
  Top 1.27: C6.2 26.03,69.37 24.12,67.46 24.12,59.4 D2.A D6.A
  Top 1.778: D6.A | D6.A | D6.A
  Bottom 1.27: C6.2 CL4.2
N$30
  Top 0.406: 26.54,60.28 D1.A
  Top 0.61: 26.54,60.28 28.57,58.25 28.57,54.45 29.52,53.49 IC4.4
  Top 1.27: C6.1 40.95,68.1 40,67.15 28.45,67.15 D5.A D1.A
  Top 1.778: D1.A | D1.A
  Bottom 1.27: C6.1 CL4.1
N$31
  Top 0.406: IC3.9 80.96,48.09 84.77,44.28 R15.1 91.12,44.28 93.02,46.19 JP11.1
N$32
  Top 0.406: IC3.4 64.45,50.63
  Top 0.61: IC4.15 55.24,50.95 55.88,50.32 62.22,50.32 62.54,50.63 IC3.4
N$33  (via drill 0.61)
  Top 0.305: v61.91,53.17 IC3.2
  Top 0.61: v29.84,47.14 IC4.9
  Bottom 0.406: v29.84,47.14 29.84,52.54 30.48,53.17 v61.91,53.17
N$35
  Top 1.016: RL1.7 RL1.2
  Bottom 1.27: RL1.7 33.65,21.43 20.32,8.09 CL9.1
N$36
  Bottom 0.305: R16.2 81.27,60.79 82.23,61.75 87.62,61.75 89.53,59.84 89.53,55.08 90.16,54.45 96.83,54.45 98.1,55.71 JP11.3
N$37
  Top 0.406: R16.1 83.81,58.89 84.45,58.25 88.26,58.25 90.8,60.79 JP10.1
N$38  (via drill 0.61)
  Top 0.305: IC3.5 65.4,49.36 65.72,49.68 65.72,55.4 v65.4,55.71
  Bottom 0.305: JP10.3 99.37,59.52 99.37,55.08 97.78,53.49 90.48,53.49 89.21,52.22 89.21,48.09 87.94,46.82 R15.2 84.77,46.82 81.91,49.68 66.03,49.68 65.4,50.32 v65.4,55.71
N$39
  Top 0.406: R13.2 47.72,34.97 48.25,34.44 49.21,34.44 49.52,34.13 Q2.1
N$40
  Bottom 1.27: CL3.1 30.79,73.18 29.84,72.23 24.44,72.23 23.49,73.18 23.49,75.72 22.54,76.67 JP8.3
N$42
  Top 0.254: CT2.9 66.35,67.46 67.62,66.19 74.92,66.19 76.19,64.92 R16.4
N$43
  Top 0.406: IC3.11 85.08,50.63 R15.3 87.62,49.36 88.26,50 88.26,53.17 87.31,54.13 73.66,54.13 73.02,54.76 73.02,57.94 70.8,60.16 CT2.4
  Bottom 0.406: CT2.4 CT2.8
N$44
  Top 0.406: CT2.6 77.15,67.46 78.73,65.88 R16.3
N$45
  Top 0.254: CT2.1 63.5,64.92 64.77,66.19 66.35,66.19 66.99,65.56 66.99,63.97 69.53,61.43 69.53,59.84 72.07,57.3 72.07,53.17
  Top 0.305: IC3.13 70.16,53.17
  Top 0.406: R15.4 85.08,53.17 72.07,53.17 IC3.13
N$55
  Top 1.016: RL1.6 RL1.3
  Bottom 1.27: RL1.6 25.39,6.19 CL9.2
N$56
  Top 1.016: RL1.5 RL1.4
  Bottom 1.27: RL1.5 30.48,6.19 CL9.3
N$58
  Top 0.406: D9.A 42.54,33.17 43.17,32.54 RL1.1 47.94,29.05 48.57,29.68 Q2.3
N$61
  Bottom 1.27: JP2.2 78.1,9.04 76.51,7.46 74.61,7.46 73.34,6.19 SERVOS.4
N$63
  Bottom 1.27: JP2.1 80.64,8.09 76.83,4.28 CL2.1
VCC  (via drill 0.61)
  Top 0.305: IC3.14 69.21,54.45 68.3,55.35 C9.2 | v49.21,26.82 55.56,33.17 58.1,33.17 59.05,34.12 IC2.28 62.86,34.12 63.5,33.49 66.99,33.49 68.42,34.92 IC2.7
  Top 0.406: R5.1 | R5.1 | R5.1 R1.1 12.59,51.8 11.43,50.63 11.43,45.24 12.7,43.97 14.92,43.97 17.77,41.11 JP6.1 31.11,41.11 31.66,40.56 31.66,36.06 32.25,35.47 36.32,35.47 37,34.79 D9.C | R5.1 | IC2.7 74.45,34.92 75.24,35.71 75.24,36.03 75.61,36.39 C5.2 | JP9.3 98.1,75.08 95.24,77.94 85.08,77.94 84.45,77.31 CP1.2 84.45,73.81 81.91,71.27 72.07,71.27 70.8,70 CT2.7 | JP10.2 JP11.2 | CT2.2 65.72,63.97 68.26,61.43 68.26,57.3 C9.2 | C8.1 48.62,41.47 43.49,36.35 38.41,36.35 37,34.93 D9.C | D9.C 37,30.49 RL1.8 | R8.1 72.07,21.11 72.07,16.98 JP7.1 72.38,14.76 70.48,12.85 R7.1
  Bottom 0.406: CT2.10 CT2.2 | CT2.5 CT2.7 70.8,68.73 70.16,69.37 63.81,69.37 63.18,68.73 CT2.10 | JP10.2 95.56,61.43 98.1,63.97 JP9.3 | 83.5,16.66 JP7.1 | 83.5,16.66 85.08,16.66 CT1.5 | 83.5,5.23 83.5,2.69 81.91,1.1 56.51,1.1 | 83.5,5.23 83.5,16.66 | JP1.2 87.62,4.6 86.99,5.23 83.5,5.23 | 39.36,19.2 39.36,15.39 40,14.76 48.57,14.76 50.16,13.17 R14.C 50.16,10.63 49.21,9.68 36.83,9.68 33.65,6.5 33.65,2.38 34.92,1.1 56.51,1.1 | 39.36,19.2 39.36,28.09 38.41,29.05 RL1.8 | v49.21,26.82 46.03,26.82 45.08,25.87 45.08,19.84 44.44,19.2 39.36,19.2 | CT2.10 60.64,67.46 58.42,65.24 58.42,58.89 55.56,56.03 27.62,56.03 19.68,48.09 JP6.1 | 56.51,1.1 CL8.1
  pour Bottom: 83.5,6.5 84.77,5.23 83.5,4.28
  pour Bottom: 39.36,20.47 40.64,19.2 39.36,17.93
  pour Bottom: 84.77,16.66 83.5,15.39 82.23,16.66
  pour Bottom: 54.92,1.1 56.51,2.69 58.1,1.1
VCC_EXT  (via drill 0.61)
  Top 0.406: JP1.3 90.16,3.96 89.53,4.6 84.77,4.6 82.23,2.06 73.34,2.06 | JP2.3 75.56,7.46 73.34,5.23 73.34,2.06 | v41.59,23.33 43.49,23.33 44.44,22.38 44.44,17.3 44.76,16.98 44.76,9.68 43.81,8.72 43.81,4.28 46.03,2.06 73.34,2.06
  Bottom 0.406: 15.55,40.16 15.87,39.84 21.9,39.84 24.12,42.06 34.6,42.06 41.59,35.08 v41.59,23.33
  Bottom 1.27: JACK.3 15.55,40.16 C4.P$1 20.63,53.81 JP8.1 | JP1.3 94.61,2.38 CL1.1
  pour Top: 73.34,2.69 72.7,2.06 73.97,2.06
VCC_USB
  Top 0.305: IC1.19 | IC1.19 23.59,16.76 23.49,16.66 | 23.49,16.66 IC1.20 | 23.81,16.66 23.49,16.66
  Top 0.406: L1.2 13.33,26.5 6.98,20.16 3.17,20.16 1.58,18.57 1.58,6.19 2.54,5.23 3.17,5.23 LED2.C | 27.44,13.31 IC1.4 | 27.3,13.17 27.44,13.31 | 27.44,13.31 27.44,14.62 25.39,16.66 23.81,16.66
  Top 0.61: JP1.1 83.81,1.1 22.86,1.1 | 22.86,2.06 22.86,2.62 22.86,8.09 27.3,12.54 27.3,13.17 | 22.86,2.06 22.86,2.04 | LED1.C 6.35,2.06 7.3,1.1 22.86,1.1 | LED1.C | LED2.C LED1.C | LED1.C | 22.86,1.1 22.86,2.06
  pour Top: 21.9,1.1 23.81,1.1 22.86,2.06
VMOTOR
  Top 0.61: IC4.6 24.76,50.95 24.12,51.59 24.12,56.35 23.49,56.98 D2.C
  Top 1.27: 21.27,61.11 D1.C | 21.27,61.11 17.77,64.61 17.77,73.18 18.73,74.13 JP8.2 22.22,74.13 23.49,75.4 23.49,76.67 24.12,77.31 53.02,77.31 54.78,75.54 54.78,62.32 55.99,61.1 | D4.C 56.08,53.17 54.78,54.47 54.78,59.89 55.99,61.1 | 55.99,61.1 D3.C | D2.C 21.27,56.98 21.27,61.11
  Top 1.778: D2.C | D2.C | D3.C | D3.C
(copper drawn outside any net)
  shapes: Top area x2

### Text on the board
tPlace: ICD2 | Pulsador | Infrarrojos | Reset | L298P | 40106 | BT | + | - | PIC16F877A | 20Mhz | Puerto D | I2C | FT232RL | GND | +5v
tNames: APM08 | RGG08 | Motor 1 | Motor 2 | SkyControl v1.0 | www.iearobotics.com